# EasyEDA schematic EasyEDA_schematic.json
TITLE: Pet Food Dispenser; REV: 1.0; Date: 2022-04-04; Sheet: 1/1; Drawn By: claudiu.nv; Company: Raveman Corp
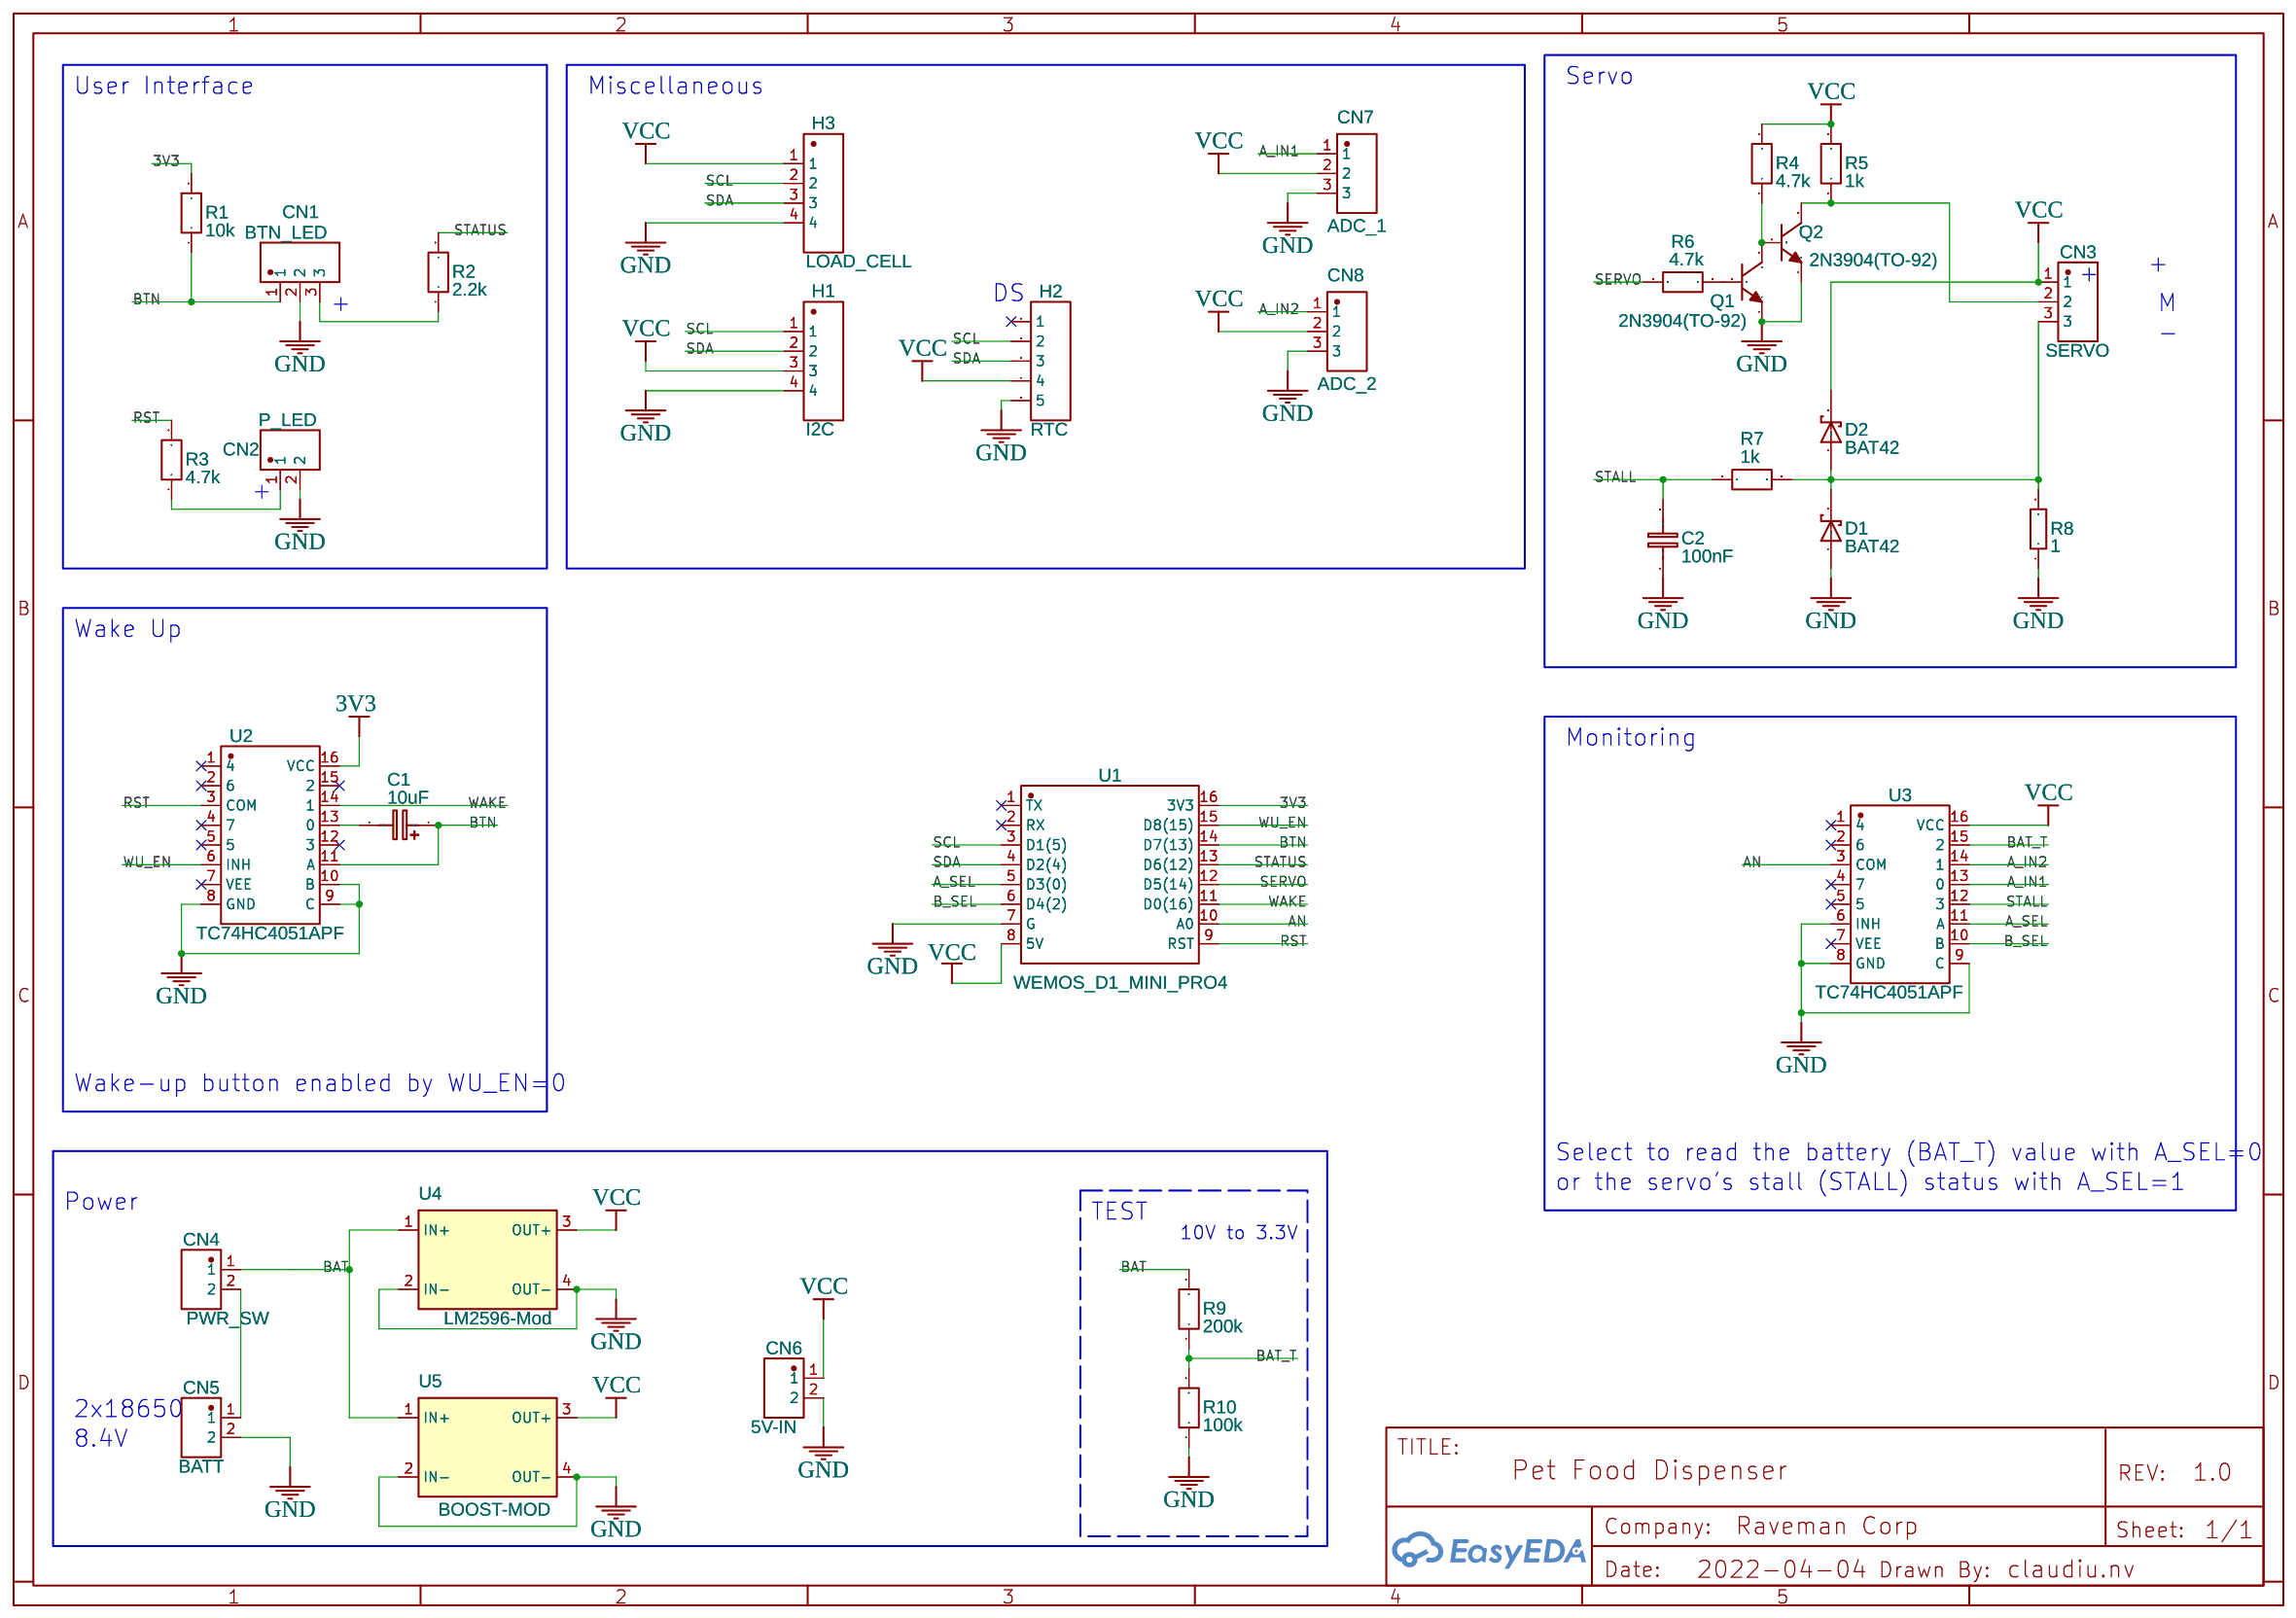
[diagram p0: schematic sheet]

## Parts
C1  10uF  [CAP-TH_BD6.3-P2.50-D1.0-FD]
C2  100nF  [CAP-TH_L7.2-W3.5-P5.00-D0.5]
CN1  BTN_LED  [CONN-TH_3P-P2.54_338006293]
CN2  P_LED  [CONN-TH_1718560002]
CN3  SERVO  [CONN-TH_3P-P2.54_338006293]
CN4  PWR_SW  [CONN-TH_1718560002]
CN5  BATT  [CONN-TH_1718560002]
CN6  5V-IN  [CONN-TH_1718560002]
CN7  ADC_1  [CONN-TH_3P-P2.54_338006293]
CN8  ADC_2  [CONN-TH_3P-P2.54_338006293]
D1  BAT42  [1N5817-TP‎]
D2  BAT42  [1N5817-TP‎]
H1  I2C  [HDR-F-2.54_1X4]
H2  RTC  [HDR-F-2.54_1X5]
H3  LOAD_CELL  [HDR-F-2.54_1X4]
Q1  2N3904(TO-92)  [TO-92-3_L5.1-W4.1-P1.27-L]
Q2  2N3904(TO-92)  [TO-92-3_L5.1-W4.1-P1.27-L]
R1  10k  [R_AXIAL-0.4]
R2  2.2k  [R_AXIAL-0.4]
R3  4.7k  [R_AXIAL-0.4]
R4  4.7k  [R_AXIAL-0.4]
R5  1k  [R_AXIAL-0.4]
R6  4.7k  [R_AXIAL-0.4]
R7  1k  [R_AXIAL-0.4]
R8  1  [RES-TH_BD9.5-L22.0-P28.00-D1.0]
R9  200k  [R_AXIAL-0.4]
R10  100k  [R_AXIAL-0.4]
U1  WEMOS_D1_MINI_PRO4  [DIP-16_WEMOS_D1_MINI_PRO4]
U2  TC74HC4051APF  [PDIP-16_L19.3-W6.4-P2.54-LS7.94-BL]
U3  TC74HC4051APF  [PDIP-16_L19.3-W6.4-P2.54-LS7.94-BL]
U4  LM2596-Mod  [LM2596-MOD-TH]
U5  BOOST-MOD  [BOOST-MOD]

## Library data of the parts
C1 = CE_TH_D3.0×F1.5_EU: Contributor: LCEDA_Lib
C2 = C_RAD-0.1_EU: Contributor: LCEDA_Lib
CN1 CN3 CN7 CN8 = 38006293: Supplier: LCSC; Supplier Part: C587424; Manufacturer: MOLEX; Contributor: LCSC; JLCPCB Part Class: Extended Part
CN2 CN4-CN6 = 1718560002: Supplier: LCSC; Supplier Part: C564997; Manufacturer: MOLEX; Contributor: LCSC
D1 D2 = 1N5817-TP: Contributor: ghuebner
H1 H3 = HEADER 4P 2.54MM: Contributor: rhalf caacbay
H2 = HDR-F-2.54_1x5: Supplier Part: C50950; Supplier: LCSC; Contributor: LCEDA_Lib
Q1 Q2 = 2N3904(TO-92): Supplier: LCSC; Manufacturer: SEMTECH; Manufacturer Part: 2N3904; Supplier Part: C118538; Contributor: LCEDA_Lib
R1 R2 R5 R6 = R_0603_EU: Contributor: LCEDA_Lib
R3 R4 R7 R9 R10 = R_AXIAL-0.5_EU: Contributor: LCEDA_Lib
R8 = CR-L5W1ΩJ: Supplier: LCSC; Supplier Part: C216404; Manufacturer: Chian Chia Elec; Contributor: LCSC; JLCPCB Part Class: Extended Part; Resistance: 1Ω
U1 = WEMOS_D1_MINI_PRO4: Supplier: LCSC; Supplier Part: C2837266; Manufacturer: null; Manufacturer Part: Wemos_D1_mini_Pro4; Contributor: LCSC; JLCPCB Part Class: Extended Part
U2 U3 = TC74HC4051APF: Supplier: LCSC; Supplier Part: C1545945; Manufacturer: TOSHIBA(东芝); Contributor: LCSC; JLCPCB Part Class: Extended Part
U4 = LM2596-Mod: Supplier: AliExpress; link: https://www.aliexpress.com/item/4001184669298.html?dp=5851e34aaafcff7cb041e669bf4e173c&af=1029176&cv=47843&afref=&mall_affr=pr3&utm_source=admitad&utm_medium=cpa&utm_campaign=1029176&utm_content=47843&dp=5851e34aaafcff7cb041e669bf4e173c&af=1029176&cv=47843&afref=&mall_affr=pr3&utm_source=admitad&utm_medium=cpa&utm_campaign=1029176&utm_content=47843&aff_fcid=d9e0761fd564461caa5f073c2456864b-1649180217740-01572-_ePNSNV&aff_fsk=_ePNSNV&aff_platform=portals-tool&sk=_ePNSNV&aff_trace_key=d9e0761fd564461caa5f073c2456864b-1649180217740-01572-_ePNSNV&terminal_id=9b84818d84964b39835dc6cab839fadb&afSmartRedirect=y; Contributor: claudiu.nv
U5 = BOOST-MOD: Supplier: AliExpress; link: https://www.aliexpress.com/item/4001184669298.html?dp=5851e34aaafcff7cb041e669bf4e173c&af=1029176&cv=47843&afref=&mall_affr=pr3&utm_source=admitad&utm_medium=cpa&utm_campaign=1029176&utm_content=47843&dp=5851e34aaafcff7cb041e669bf4e173c&af=1029176&cv=47843&afref=&mall_affr=pr3&utm_source=admitad&utm_medium=cpa&utm_campaign=1029176&utm_content=47843&aff_fcid=d9e0761fd564461caa5f073c2456864b-1649180217740-01572-_ePNSNV&aff_fsk=_ePNSNV&aff_platform=portals-tool&sk=_ePNSNV&aff_trace_key=d9e0761fd564461caa5f073c2456864b-1649180217740-01572-_ePNSNV&terminal_id=9b84818d84964b39835dc6cab839fadb&afSmartRedirect=y; Contributor: claudiu.nv

## Nets
3V3: R1.2 U1.16(3V3) U2.16(VCC)
GND: C2.1 CN1.2 CN2.2 CN5.2 CN6.2 CN7.3 CN8.3 D1.A H1.4 H2.5 H3.4 Q1.1(E) Q2.1(E) R8.1 R10.1 U1.7(G) U2.8(GND) U2.9(C) U2.10(B) U3.6(INH) U3.8(GND) U3.9(C) U4.2(IN-) U4.4(OUT-) U5.2(IN-) U5.4(OUT-)
VCC: CN3.1 CN6.1 CN7.2 CN8.2 D2.C H1.3 H2.4 H3.1 R4.2 R5.2 U1.8(5V) U3.16(VCC) U4.3(OUT+) U5.3(OUT+)
A_IN1: CN7.1 U3.13(0)
A_IN2: CN8.1 U3.14(1)
A_SEL: U1.5(D3(0)) U3.11(A)
AN: U1.10(A0) U3.3(COM)
B_SEL: U1.6(D4(2)) U3.10(B)
BAT: CN4.1 R9.2 U4.1(IN+) U5.1(IN+)
BAT_T: R9.1 R10.2 U3.15(2)
BTN: C1.1 CN1.1 R1.1 U1.14(D7(13)) U2.11(A)
RST: R3.2 U1.9(RST) U2.3(COM)
SCL: H1.1 H2.2 H3.2 U1.3(D1(5))
SDA: H1.2 H2.3 H3.3 U1.4(D2(4))
SERVO: R6.1 U1.12(D5(14))
STALL: C2.2 R7.1 U3.12(3)
STATUS: R2.2 U1.13(D6(12))
WAKE: U1.11(D0(16)) U2.14(1)
WU_EN: U1.15(D8(15)) U2.6(INH)
Net-(C1-2): C1.2 U2.13(0)
Net-(CN1-3): CN1.3 R2.1
Net-(CN2-1): CN2.1 R3.1
Net-(CN3-2): CN3.2 Q2.3(C) R5.1
Net-(CN3-3): CN3.3 D1.C D2.A R7.2 R8.2
Net-(CN4-2): CN4.2 CN5.1
Net-(Q1-2): Q1.2(B) R6.2
Net-(Q1-3): Q1.3(C) Q2.2(B) R4.1

Not connected (* = marked no-connect by the designer): H2 1*; U1 1(TX)* 2(RX)*; U2 1(4)* 2(6)* 4(7)* 5* 7(VEE)* 12(3)* 15(2)*; U3 1(4)* 2(6)* 4(7)* 5* 7(VEE)*

## Notes on the sheet
- Servo
- User Interface
- Miscellaneous
- +
- +
- +
- DS
- M
- -
- +
- Wake Up
- Monitoring
- Wake-up button enabled by WU_EN=0
- Select to read the battery (BAT_T) value with A_SEL=0
- Power
- or the servo's stall (STALL) status with A_SEL=1
- TEST
- 10V to 3.3V
- 2x18650
- 8.4V
